# EAGLE schematic upper_meter (EAGLE 6.3)
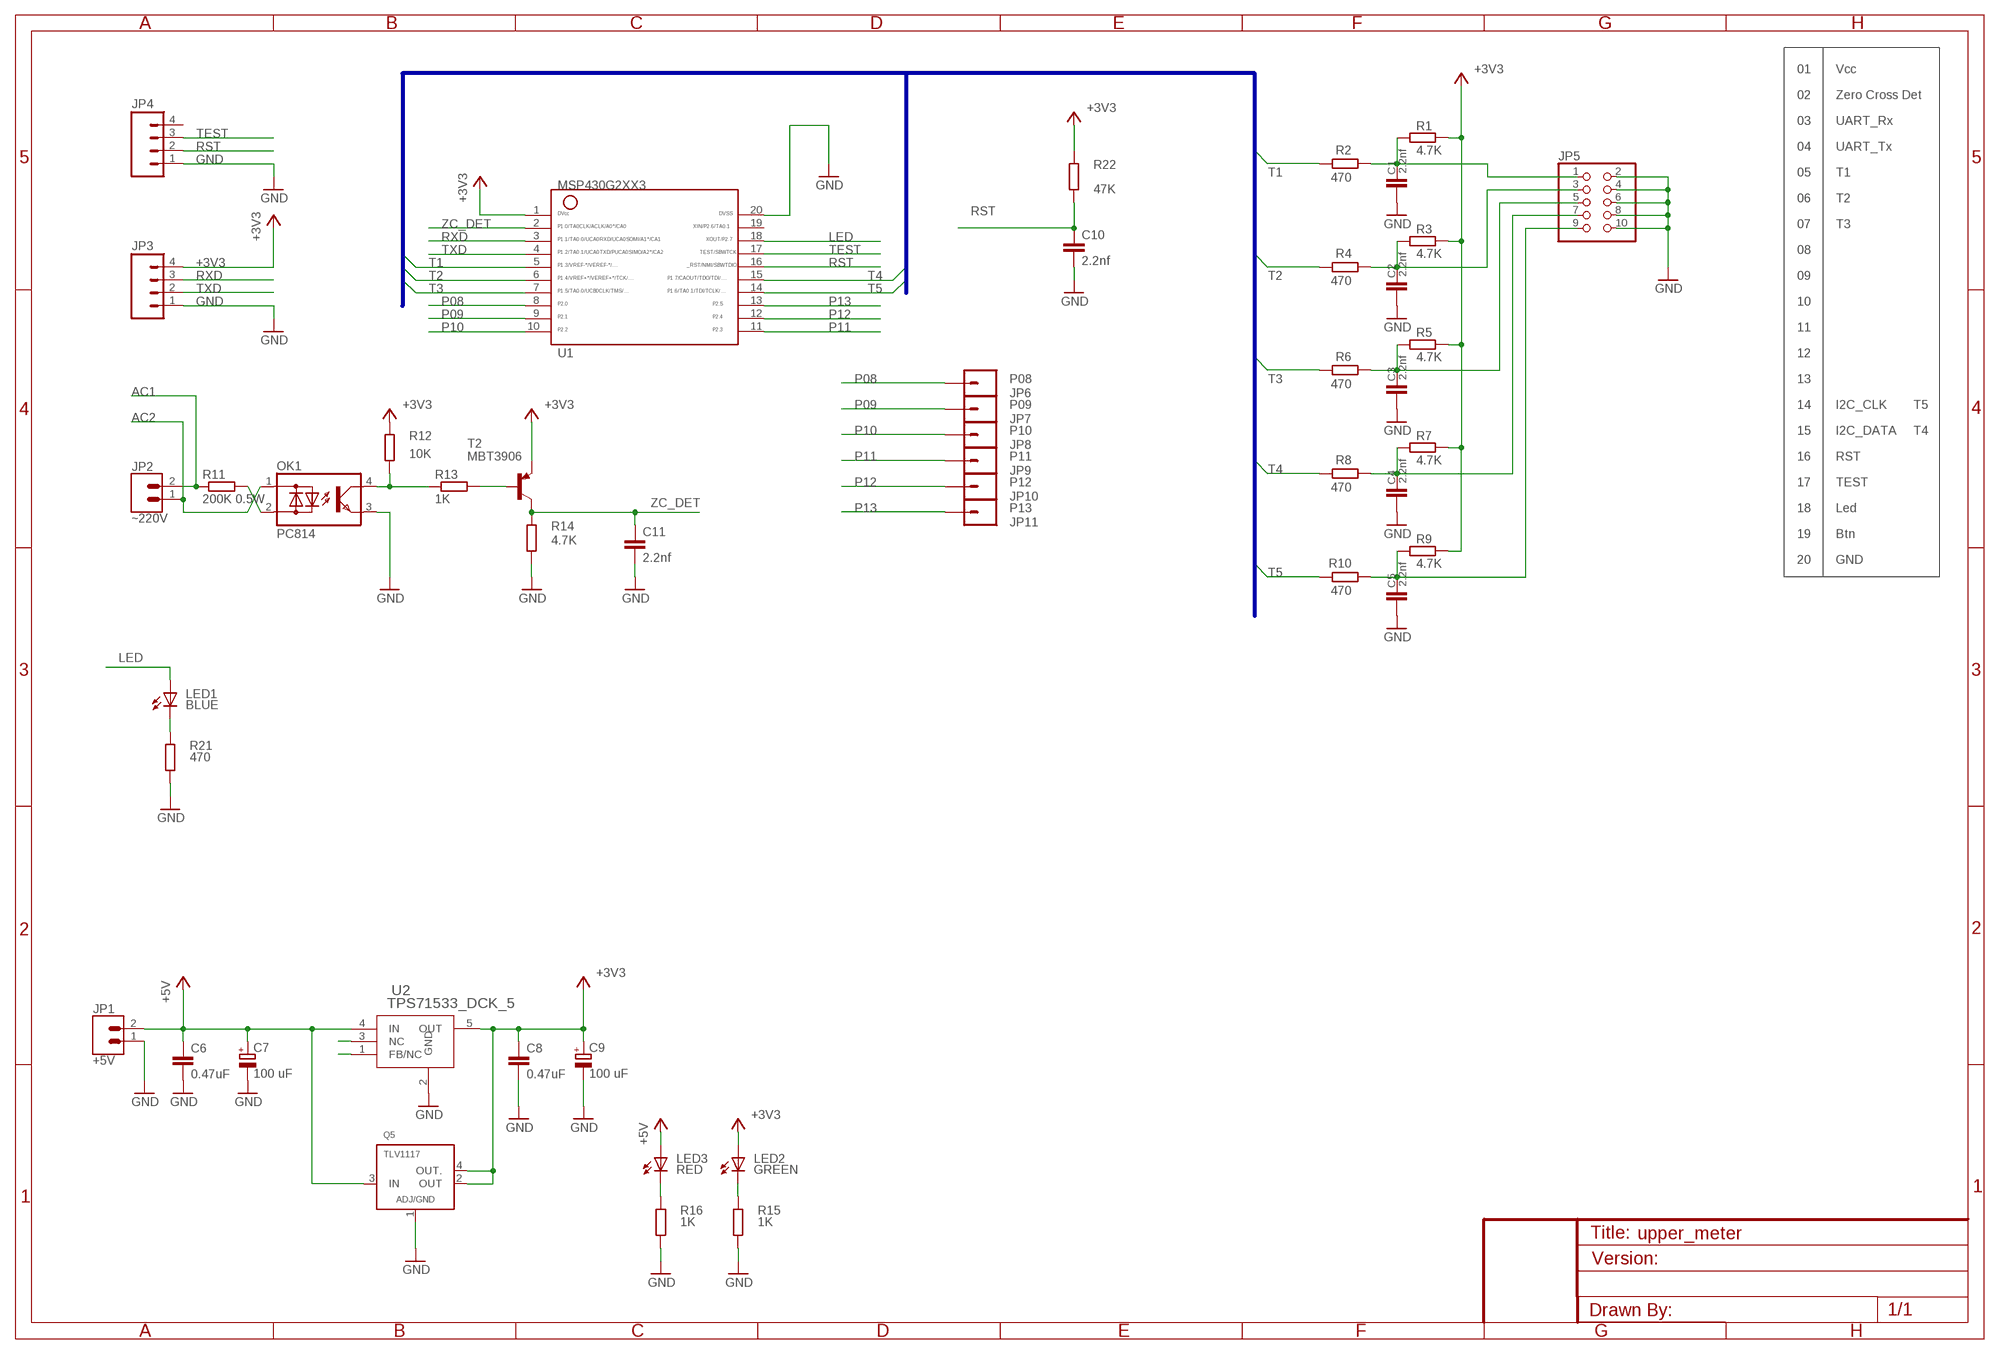
[diagram p0: schematic, sheet 1]

## Parts
C1  2.2nf  C-EUC0805  [C0805]
C2  2.2nf  C-EUC0805  [C0805]
C3  2.2nf  C-EUC0805  [C0805]
C4  2.2nf  C-EUC0805  [C0805]
C5  2.2nf  C-EUC0805  [C0805]
C6  0.47uF  C-EUC0805  [C0805]
C7  100 uF  CPOL-EUE2.5-7  [E2,5-7]
C8  0.47uF  C-EUC0805  [C0805]
C9  100 uF  CPOL-EUE2.5-7  [E2,5-7]
C10  2.2nf  C-EUC0805  [C0805]
C11  2.2nf  C-EUC0805  [C0805]
JP1  +5V  BLUE_TERM  [BLUE_TERM]
JP2  ~220V  BLUE_TERM  [BLUE_TERM]
JP3  M04PTH  [1X04]
JP4  M04PTH  [1X04]
JP5  PINHD-2X5  [2X05]
JP6  P08  M01PTH  [1X01]
JP7  P09  M01PTH  [1X01]
JP8  P10  M01PTH  [1X01]
JP9  P11  M01PTH  [1X01]
JP10  P12  M01PTH  [1X01]
JP11  P13  M01PTH  [1X01]
LED1  BLUE  LEDCHIP-LED0805  [CHIP-LED0805]
LED2  GREEN  LEDCHIP-LED0805  [CHIP-LED0805]
LED3  RED  LEDCHIP-LED0805  [CHIP-LED0805]
OK1  PC814  [DIL04]
Q5  TLV1117  [SOT223-4]
R1  4.7K  R-EU_R0805  [R0805]
R2  470  R-EU_R0805  [R0805]
R3  4.7K  R-EU_R0805  [R0805]
R4  470  R-EU_R0805  [R0805]
R5  4.7K  R-EU_R0805  [R0805]
R6  470  R-EU_R0805  [R0805]
R7  4.7K  R-EU_R0805  [R0805]
R8  470  R-EU_R0805  [R0805]
R9  4.7K  R-EU_R0805  [R0805]
R10  470  R-EU_R0805  [R0805]
R11  200K 0.5W  R-EU_0309/12  [0309/12]
R12  10K  R-EU_R0805  [R0805]
R13  1K  R-EU_R0805  [R0805]
R14  4.7K  R-EU_R0805  [R0805]
R15  1K  R-EU_R0805  [R0805]
R16  1K  R-EU_R0805  [R0805]
R21  470  R-EU_R0805  [R0805]
R22  47K  R-EU_R0805  [R0805]
T2  MBT3906  MMBT3906LT1-PNP-SOT23-BEC  [SOT23-BEC]
U1  G2XX3---PW20  [PW20]
U2  TPS71533_DCK_5  [DCK5]

## Nets
+3V3 [3V]: C8.1 C9.+ JP3.4 LED2.A Q5.2(OUT) Q5.4(OUT.) R1.1 R3.1 R5.1 R7.1 R9.1 R12.2 R22.2 T2.E U1.1 U2.5(OUT)
+5V [5V]: C6.1 C7.+ JP1.2 LED3.A Q5.3(IN) U2.4(IN)
AC1: JP2.2 R11.1
AC2: JP2.1 OK1.1(AC1)
GND [GND]: C1.1 C2.1 C3.1 C4.1 C5.1 C6.2 C7.- C8.2 C9.- C10.2 C11.2 JP1.1 JP3.1 JP4.1 JP5.2 JP5.4 JP5.6 JP5.8 JP5.10 OK1.3(E) Q5.1(ADJ/GND) R14.1 R15.1 R16.1 R21.1 U1.20 U2.2(GND)
LED: LED1.A U1.18
N$1: C2.2 JP5.3 R3.2 R4.2
N$2: C1.2 JP5.1 R1.2 R2.2
N$3: C3.2 JP5.5 R5.2 R6.2
N$4: C4.2 JP5.7 R7.2 R8.2
N$5: C5.2 JP5.9 R9.2 R10.2
N$6: R13.2 T2.B
N$7: LED2.C R15.2
N$8: LED3.C R16.2
N$9: OK1.4(C) R12.1 R13.1
N$15: OK1.2(AC2) R11.2
N$23: LED1.C R21.2
N$32: U2.3(NC)
N$33: U2.1(FB/NC)
P08: JP6.1 U1.8
P09: JP7.1 U1.9
P10: JP8.1 U1.10
P11: JP9.1 U1.11
P12: JP10.1 U1.12
P13: JP11.1 U1.13
RST: C10.1 JP4.2 R22.1 U1.16
RXD: JP3.3 U1.3
T1: R2.1 U1.5
T2: R4.1 U1.6
T3: R6.1 U1.7
T4: R8.1 U1.15
T5: R10.1 U1.14
TEST: JP4.3 U1.17
TXD: JP3.2 U1.4
ZC_DET: C11.1 R14.2 T2.C U1.2
Unconnected: JP4.4 U1.19

## Buses
T[1..5]

## Notes on the sheet
- 01 | Vcc
- 02 | Zero Cross Det
- 03 | UART_Rx
- 04 | UART_Tx
- 05 | T1
- 06 | T2
- 07 | T3
- 08
- 09
- 10
- 11
- 12
- 13
- 14 | I2C_CLK | T5
- 15 | I2C_DATA | T4
- 16 | RST
- 17 | TEST
- 18 | Led
- 19 | Btn
- 20 | GND

## Library data of the parts
C1-C4 C6 C8 C10 C11 = rcl:C-EU: CAPACITOR, European symbol
C5 = resistor:C-EU: CAPACITOR, European symbol
C7 C9 = rcl:CPOL-EU: POLARIZED CAPACITOR, European symbol
JP1 JP2 = jlab:BLUE_TERM
JP3 JP4 = SparkFun:M04: Header 4 Standard 4-pin 0.1" header. Use with straight break away headers (SKU : PRT-00116), right angle break away headers (PRT-00553), swiss pins (PRT-00743), machine pins (PRT-00117), and female headers (PRT-00115). Molex polarized connector foot print use with SKU : PRT-08231 with associated crimp pins and housings. 1MM SMD Version SKU: PRT-10208
JP5 = pinhead:PINHD-2X5: PIN HEADER
JP6-JP11 = SparkFun:M01: Header 1 Standard 1-pin 0.1" header. Use with straight break away headers (SKU : PRT-00116), right angle break away headers (PRT-00553), swiss pins (PRT-00743), machine pins (PRT-00117), and female headers (PRT-00115).
LED1-LED3 = jlab:LED: LED OSRAM: - CHIPLED LG R971, LG N971, LY N971, LG Q971, LY Q971, LO R971, LY R971 LH N974, LH R974 LS Q976, LO Q976, LY Q976 LO Q996 - Hyper CHIPLED LW Q18S LB Q993, LB Q99A, LB R99A - SideLED LS A670, LO A670, LY A670, LG A670, LP A670 LB A673, LV A673, LT A673, LW A673 LH A674 LY A675 LS A676, LA A676, LO A676, LY A676, LW A676 LS A679, LY A679, LG A679 - Hyper Micro SIDELED® LS Y876, LA Y876, LO Y876, LY Y876 LT Y87S - SmartLED LW L88C, LW L88S LB L89C, LB L89S, LG L890 LS L89K, LO L89K, LY L89K LS L896, LA L896, LO L896, LY L896 - TOPLED LS T670, LO T670, LY T670, LG T670, LP T670 LSG T670, LSP T670, LSY T670, LOP T670, LYG T670 LG T671, LOG T671, LSG T671 LB T673, LV T673, LT T673, LW T673 LH T674 LS T676, LA T676, LO T676, LY T676, LB T676, LH T676, LSB T676, LW T676 LB T67C, LV T67C, LT T67C, LS T67K, LO T67K, LY T67K, LW E67C LS E67B, LA E67B, LO E67B, LY E67B, LB E67C, LV E67C, LT E67C LW T67C LS T679, LY T679, LG T679 LS T770, LO T770, LY T770, LG T770, LP T770 LB T773, LV T773, LT T773, LW T773 LH T774 LS E675, LA E675, LY E675, LS T675 LS T776, LA T776, LO T776, LY T776, LB T776 LHGB T686 LT T68C, LB T68C - Hyper Mini TOPLED® LB M676 - Mini TOPLED Santana® LG M470 LS M47K, LO M47K, LY M47K Source: http://www.osram.convergy.de LUXEON: - LUMILED® LXK2-PW12-R00, LXK2-PW12-S00, LXK2-PW14-U00, LXK2-PW14-V00 LXK2-PM12-R00, LXK2-PM12-S00, LXK2-PM14-U00 LXK2-PE12-Q00, LXK2-PE12-R00, LXK2-PE12-S00, LXK2-PE14-T00, LXK2-PE14-U00 LXK2-PB12-K00, LXK2-PB12-L00, LXK2-PB12-M00, LXK2-PB14-N00, LXK2-PB14-P00, LXK2-PB14-Q00 LXK2-PR12-L00, LXK2-PR12-M00, LXK2-PR14-Q00, LXK2-PR14-R00 LXK2-PD12-Q00, LXK2-PD12-R00, LXK2-PD12-S00 LXK2-PH12-R00, LXK2-PH12-S00 LXK2-PL12-P00, LXK2-PL12-Q00, LXK2-PL12-R00 Source: www.luxeon.com KINGBRIGHT: KA-3528ASYC Source: www.kingbright.com
OK1 = optocoupler:PC814: SHARP OPTO COUPLER; OC_FARNELL: 9707662; OC_NEWARK: unknown
Q5 = ti-parts:TLV1117: LDO VOLTAGE REGULATOR
R1-R16 R21 R22 = rcl:R-EU_: RESISTOR, European symbol
T2 = transistor-neu-to92:*-PNP-: PNP Transistror
U1 = TI_MSP430_v16:G2XX3---PW20: MSP430G2XX1 TSSOP (PW) 20 Pin Package
U2 = ti_exports:TPS71533_DCK_5; DATASHEETURL: http://www.ti.com/lit/gpn/TPS71533; DESCRIPTION: Single Output LDO, 50mA, Fixed(3.3V), High Input Voltage, Low Quiescent Current; FAMILY_NAME: SINGLE CHANNEL LDO; GENERIC_PART_NUMBER: TPS71533; INDUSTRY_STD_PKG_TYPE: SC70; MANUFACTURER: Texas Instruments; MANUFACTURER_PART_NUMBER: tps71533_dck_5; PACKAGE_DESIGNATOR: DCK; PIN_COUNT: 5; VENDOR: Texas Instruments

## Net classes
1 5V: width 0.305 mm, drill 0.305 mm, clearance 0.305 mm
2 3V: width 0.305 mm, drill 0.305 mm, clearance 0.305 mm
3 GND: width 0.305 mm, clearance 0.305 mm